# Altium schematic sheet JTAG-SW Connector.SchDoc
size A4; SheetNumber: 2; SheetTotal: 7
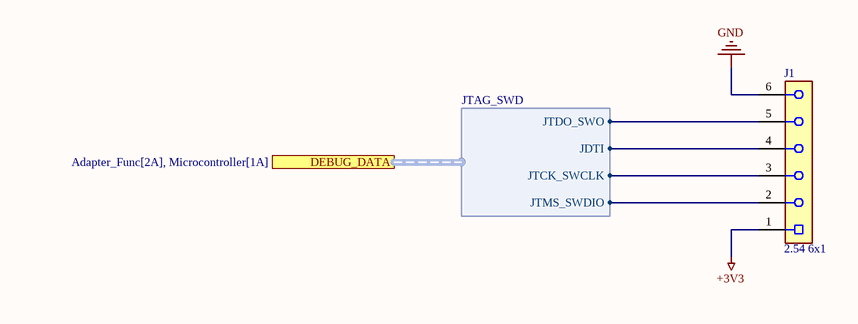
[diagram p0: JTAG-SW Connector.SchDoc]

## Parts
J1  2.54 6x1  [PLS-6x1]

## Ports
DEBUG_DATA (harness JTAG_SWD, see Adapter_Func[2A], Microcontroller[1A])

## Harnesses
JTAG_SWD: JDTI, JTDO_SWO, JTMS_SWDIO, JTCK_SWCLK

## Nets
+3V3: J1.1
GND: J1.6
NetJ1_2: J1.2 ; port DEBUG_DATA.JTMS_SWDIO
NetJ1_3: J1.3 ; port DEBUG_DATA.JTCK_SWCLK
NetJ1_4: J1.4 ; port DEBUG_DATA.JDTI
NetJ1_5: J1.5 ; port DEBUG_DATA.JTDO_SWO

## Library data of the parts
J1 = 2.54mm 6x1